# Altium project LED_Board.PrjPcb
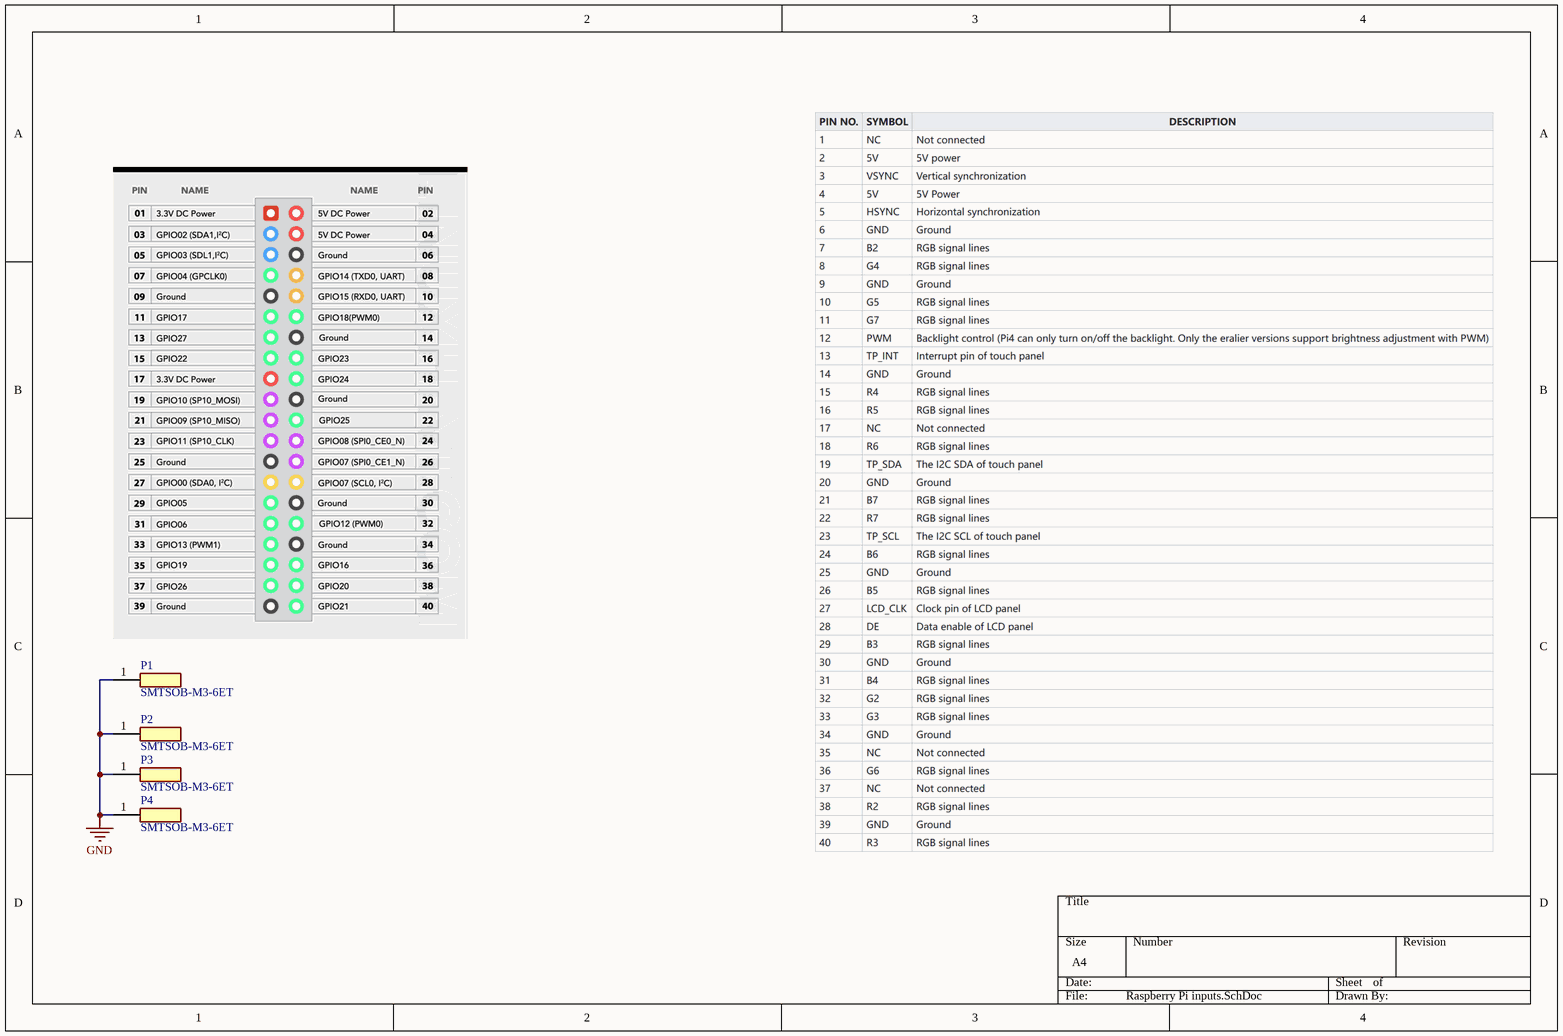
[diagram p0: Raspberry Pi inputs.SchDoc]
3 sheets, 57 parts. Net scope: flat (ports and power ports of the same name join across sheets).
Board file: PCB.PcbDoc
Sheets:
  Raspberry Pi inputs.SchDoc
  LEDs_Sheet_1.SchDoc
  LEDs_Sheet_2.SchDoc

## Sheet Raspberry Pi inputs.SchDoc
size A4; SheetNumber: 1; SheetTotal: 3

### Parts
P1  SMTSOB-M3-6ET  [SMTSOB-M3-6ET]
P2  SMTSOB-M3-6ET  [SMTSOB-M3-6ET]
P3  SMTSOB-M3-6ET  [SMTSOB-M3-6ET]
P4  SMTSOB-M3-6ET  [SMTSOB-M3-6ET]

### Nets
GND: P1.1 P2.1 P3.1 P4.1

### Library data of the parts
P1-P4 = SMTSOB-M3-6ET: Spacer 8mm

## Sheet LEDs_Sheet_1.SchDoc
size A4; SheetNumber: 2; SheetTotal: 3
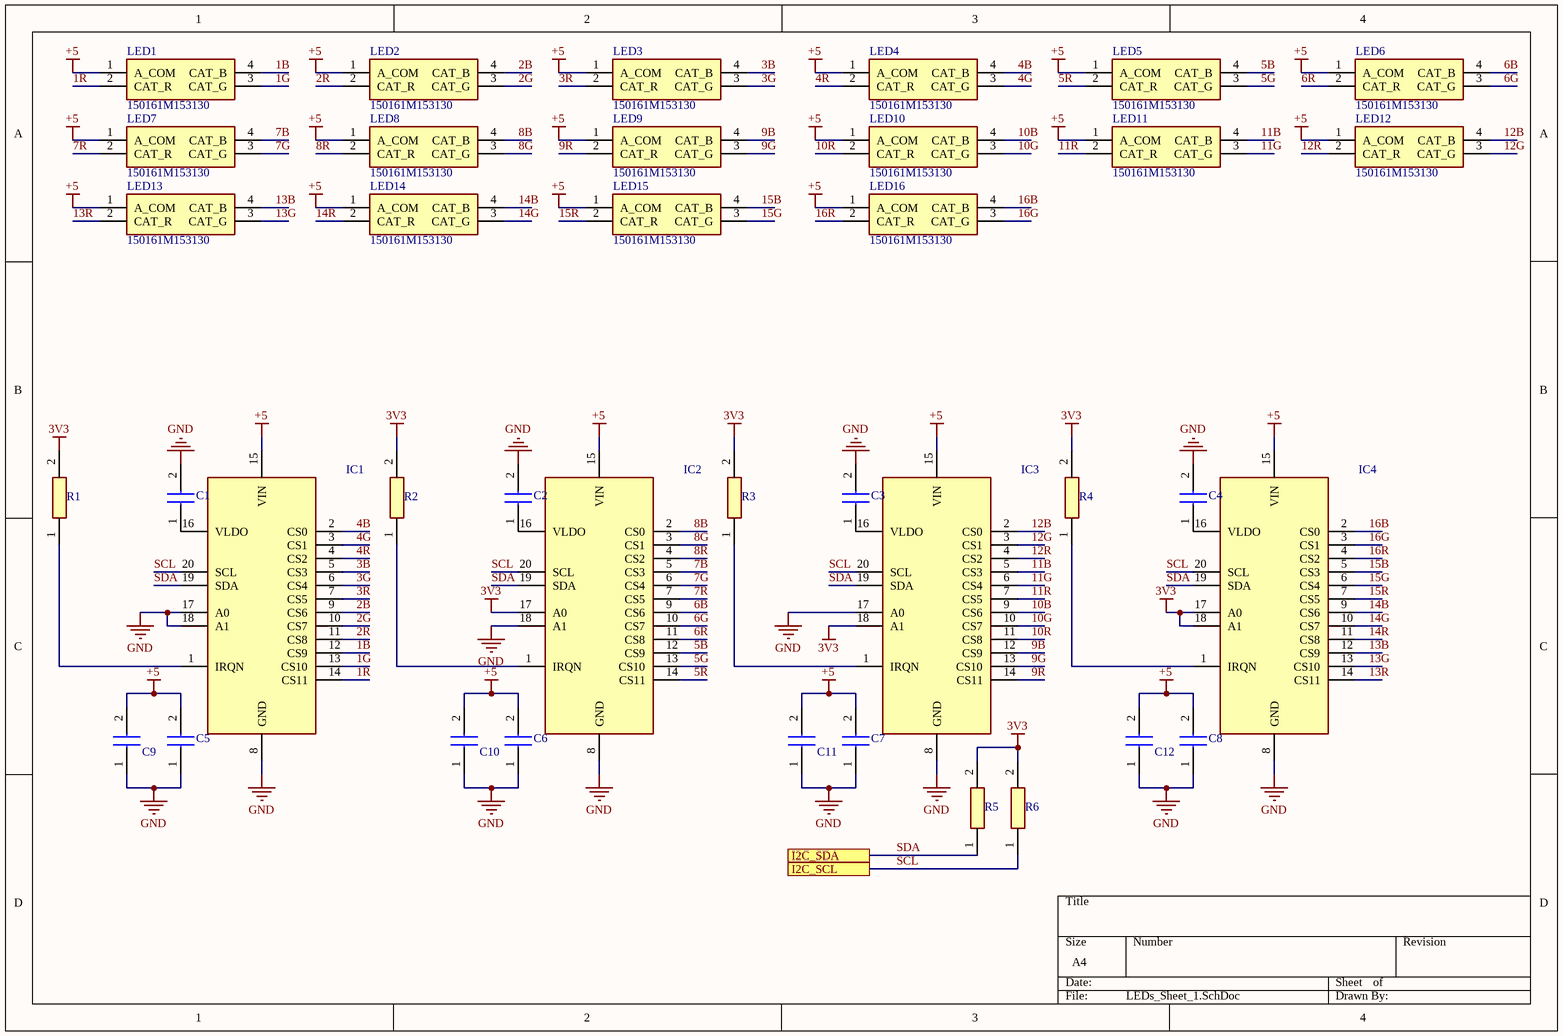
[diagram p1: LEDs_Sheet_1.SchDoc]

### Parts
C1  C0402C105K9PAC  [CAPC1005X55N]  (value not drawn)
C2  C0402C105K9PAC  [CAPC1005X55N]  (value not drawn)
C3  C0402C105K9PAC  [CAPC1005X55N]  (value not drawn)
C4  C0402C105K9PAC  [CAPC1005X55N]  (value not drawn)
C5  C0402C105K9PAC  [CAPC1005X55N]  (value not drawn)
C6  C0402C105K9PAC  [CAPC1005X55N]  (value not drawn)
C7  C0402C105K9PAC  [CAPC1005X55N]  (value not drawn)
C8  C0402C105K9PAC  [CAPC1005X55N]  (value not drawn)
C9  C1005X7S1A225K050BC  [C1005_Commercial]  (value not drawn)
C10  C1005X7S1A225K050BC  [C1005_Commercial]  (value not drawn)
C11  C1005X7S1A225K050BC  [C1005_Commercial]  (value not drawn)
C12  C1005X7S1A225K050BC  [C1005_Commercial]  (value not drawn)
IC1  LED1202JR  [QFN20 3x3 (0,5mm pitch)]  (value not drawn)
IC2  LED1202JR  [QFN20 3x3 (0,5mm pitch)]  (value not drawn)
IC3  LED1202JR  [QFN20 3x3 (0,5mm pitch)]  (value not drawn)
IC4  LED1202JR  [QFN20 3x3 (0,5mm pitch)]  (value not drawn)
LED1  150161M153130  [150161M153130]
LED2  150161M153130  [150161M153130]
LED3  150161M153130  [150161M153130]
LED4  150161M153130  [150161M153130]
LED5  150161M153130  [150161M153130]
LED6  150161M153130  [150161M153130]
LED7  150161M153130  [150161M153130]
LED8  150161M153130  [150161M153130]
LED9  150161M153130  [150161M153130]
LED10  150161M153130  [150161M153130]
LED11  150161M153130  [150161M153130]
LED12  150161M153130  [150161M153130]
LED13  150161M153130  [150161M153130]
LED14  150161M153130  [150161M153130]
LED15  150161M153130  [150161M153130]
LED16  150161M153130  [150161M153130]
R1  MCS04020D1001BE000  [RESC1005X37N]  (value not drawn)
R2  MCS04020D1001BE000  [RESC1005X37N]  (value not drawn)
R3  MCS04020D1001BE000  [RESC1005X37N]  (value not drawn)
R4  MCS04020D1001BE000  [RESC1005X37N]  (value not drawn)
R5  MCS04020D1001BE000  [RESC1005X37N]  (value not drawn)
R6  MCS04020D1001BE000  [RESC1005X37N]  (value not drawn)

### Ports
I2C_SCL, I2C_SDA

### Nets
3V3: IC2.17(A0) IC3.18(A1) IC4.17(A0) IC4.18(A1) R1.2 R2.2 R3.2 R4.2 R5.2 R6.2
+5: C5.2 C6.2 C7.2 C8.2 C9.2 C10.2 C11.2 C12.2 IC1.15(VIN) IC2.15(VIN) IC3.15(VIN) IC4.15(VIN) LED1.1(A_COM) LED2.1(A_COM) LED3.1(A_COM) LED4.1(A_COM) LED5.1(A_COM) LED6.1(A_COM) LED7.1(A_COM) LED8.1(A_COM) LED9.1(A_COM) LED10.1(A_COM) LED11.1(A_COM) LED12.1(A_COM) LED13.1(A_COM) LED14.1(A_COM) LED15.1(A_COM) LED16.1(A_COM)
GND: C1.2 C2.2 C3.2 C4.2 C5.1 C6.1 C7.1 C8.1 C9.1 C10.1 C11.1 C12.1 IC1.8(GND) IC1.17(A0) IC1.18(A1) IC2.8(GND) IC2.18(A1) IC3.8(GND) IC3.17(A0) IC4.8(GND)
1B: IC1.12(CS9) LED1.4(CAT_B)
1G: IC1.13(CS10) LED1.3(CAT_G)
1R: IC1.14(CS11) LED1.2(CAT_R)
2B: IC1.9(CS6) LED2.4(CAT_B)
2G: IC1.10(CS7) LED2.3(CAT_G)
2R: IC1.11(CS8) LED2.2(CAT_R)
3B: IC1.5(CS3) LED3.4(CAT_B)
3G: IC1.6(CS4) LED3.3(CAT_G)
3R: IC1.7(CS5) LED3.2(CAT_R)
4B: IC1.2(CS0) LED4.4(CAT_B)
4G: IC1.3(CS1) LED4.3(CAT_G)
4R: IC1.4(CS2) LED4.2(CAT_R)
5B: IC2.12(CS9) LED5.4(CAT_B)
5G: IC2.13(CS10) LED5.3(CAT_G)
5R: IC2.14(CS11) LED5.2(CAT_R)
6B: IC2.9(CS6) LED6.4(CAT_B)
6G: IC2.10(CS7) LED6.3(CAT_G)
6R: IC2.11(CS8) LED6.2(CAT_R)
7B: IC2.5(CS3) LED7.4(CAT_B)
7G: IC2.6(CS4) LED7.3(CAT_G)
7R: IC2.7(CS5) LED7.2(CAT_R)
8B: IC2.2(CS0) LED8.4(CAT_B)
8G: IC2.3(CS1) LED8.3(CAT_G)
8R: IC2.4(CS2) LED8.2(CAT_R)
9B: IC3.12(CS9) LED9.4(CAT_B)
9G: IC3.13(CS10) LED9.3(CAT_G)
9R: IC3.14(CS11) LED9.2(CAT_R)
10B: IC3.9(CS6) LED10.4(CAT_B)
10G: IC3.10(CS7) LED10.3(CAT_G)
10R: IC3.11(CS8) LED10.2(CAT_R)
11B: IC3.5(CS3) LED11.4(CAT_B)
11G: IC3.6(CS4) LED11.3(CAT_G)
11R: IC3.7(CS5) LED11.2(CAT_R)
12B: IC3.2(CS0) LED12.4(CAT_B)
12G: IC3.3(CS1) LED12.3(CAT_G)
12R: IC3.4(CS2) LED12.2(CAT_R)
13B: IC4.12(CS9) LED13.4(CAT_B)
13G: IC4.13(CS10) LED13.3(CAT_G)
13R: IC4.14(CS11) LED13.2(CAT_R)
14B: IC4.9(CS6) LED14.4(CAT_B)
14G: IC4.10(CS7) LED14.3(CAT_G)
14R: IC4.11(CS8) LED14.2(CAT_R)
15B: IC4.5(CS3) LED15.4(CAT_B)
15G: IC4.6(CS4) LED15.3(CAT_G)
15R: IC4.7(CS5) LED15.2(CAT_R)
16B: IC4.2(CS0) LED16.4(CAT_B)
16G: IC4.3(CS1) LED16.3(CAT_G)
16R: IC4.4(CS2) LED16.2(CAT_R)
SCL: IC1.20(SCL) IC2.20(SCL) IC3.20(SCL) IC4.20(SCL) R6.1 ; port I2C_SCL
SDA: IC1.19(SDA) IC2.19(SDA) IC3.19(SDA) IC4.19(SDA) R5.1 ; port I2C_SDA
NetC1_1: C1.1 IC1.16(VLDO)
NetC2_1: C2.1 IC2.16(VLDO)
NetC3_1: C3.1 IC3.16(VLDO)
NetC4_1: C4.1 IC4.16(VLDO)
NetIC1_1: IC1.1(IRQN) R1.1
NetIC2_1: IC2.1(IRQN) R2.1
NetIC3_1: IC3.1(IRQN) R3.1
NetIC4_1: IC4.1(IRQN) R4.1

### Library data of the parts
C1-C8 = C0402C105K9PAC: Capacitor; Manufacturer_Name: KEMET; Datasheet Link: https://content.kemet.com/datasheets/KEM_C1002_X7R_SMD.pdf; Height: 0.55mm; Manufacturer_Part_Number: C0402C105K9PAC; Mouser Part Number: 80-C0402C105K9PAC; Mouser Price/Stock: https://www.mouser.co.uk/ProductDetail/KEMET/C0402C105K9PAC?qs=AHS6Mz2dKxPyNrxaU50ZkQ%3D%3D; Arrow Part Number: C0402C105K9PAC; Arrow Price/Stock: https://www.arrow.com/en/products/c0402c105k9pac/kemet-corporation?region=nac
C9-C12 = C1005X7S1A225K050BC: 2µ2F 0402; Manufacturer_Name: TDK; Datasheet Link: https://product.tdk.com/system/files/dam/doc/product/capacitor/ceramic/mlcc/catalog/mlcc_commercial_general_en.pdf; Height: 0.55mm; Manufacturer_Part_Number: C1005X7S1A225K050BC; Mouser Part Number: 810-C1005X7S1A225K; Mouser Price/Stock: https://www.mouser.co.uk/ProductDetail/TDK/C1005X7S1A225K050BC?qs=dfay7wIA1uFANmjMJAzwOA%3D%3D; Arrow Part Number: C1005X7S1A225K050BC; Arrow Price/Stock: https://www.arrow.com/en/products/c1005x7s1a225k050bc/tdk?region=nac
IC1-IC4 = LED1202JR: Integrated Circuit; Manufacturer_Name: STMicroelectronics; Datasheet Link: https://componentsearchengine.com/Datasheets/1/LED1202JR.pdf; Height: 0.653mm; Manufacturer_Part_Number: LED1202JR; Mouser Part Number: 511-LED1202JR; Mouser Price/Stock: https://www.mouser.co.uk/ProductDetail/STMicroelectronics/LED1202JR?qs=P19jvy6W2mcPsIm9dkDZbQ%3D%3D; Arrow Part Number: LED1202JR; Arrow Price/Stock: https://www.arrow.com/en/products/led1202jr/stmicroelectronics?region=nac
LED1-LED16 = 150161M153130: LED; Manufacturer_Name: Wurth Elektronik; Datasheet Link: https://www.mouser.co.uk/datasheet/2/445/150161M153130-1838821.pdf; Height: 1.7mm; Manufacturer_Part_Number: 150161M153130; Mouser Part Number: 710-150161M153130; Mouser Price/Stock: https://www.mouser.co.uk/ProductDetail/Wurth-Elektronik/150161M153130?qs=GedFDFLaBXEcD4evLrps3w%3D%3D
R1-R6 = MCS04020D1001BE000: Resistor 1k 0402; Manufacturer_Name: Vishay; Datasheet Link: http://www.vishay.com/docs/28705/mcx0x0xpro.pdf; Height: 0.37mm; Manufacturer_Part_Number: MCS04020D1001BE000; Mouser Part Number: 594-MCS04020D1001BE0; Mouser Price/Stock: https://www.mouser.co.uk/ProductDetail/Vishay-Beyschlag/MCS04020D1001BE000?qs=H5EaGE3Pc5m43MFwYZQH1Q%3D%3D

## Sheet LEDs_Sheet_2.SchDoc
size A4; SheetNumber: 3; SheetTotal: 3
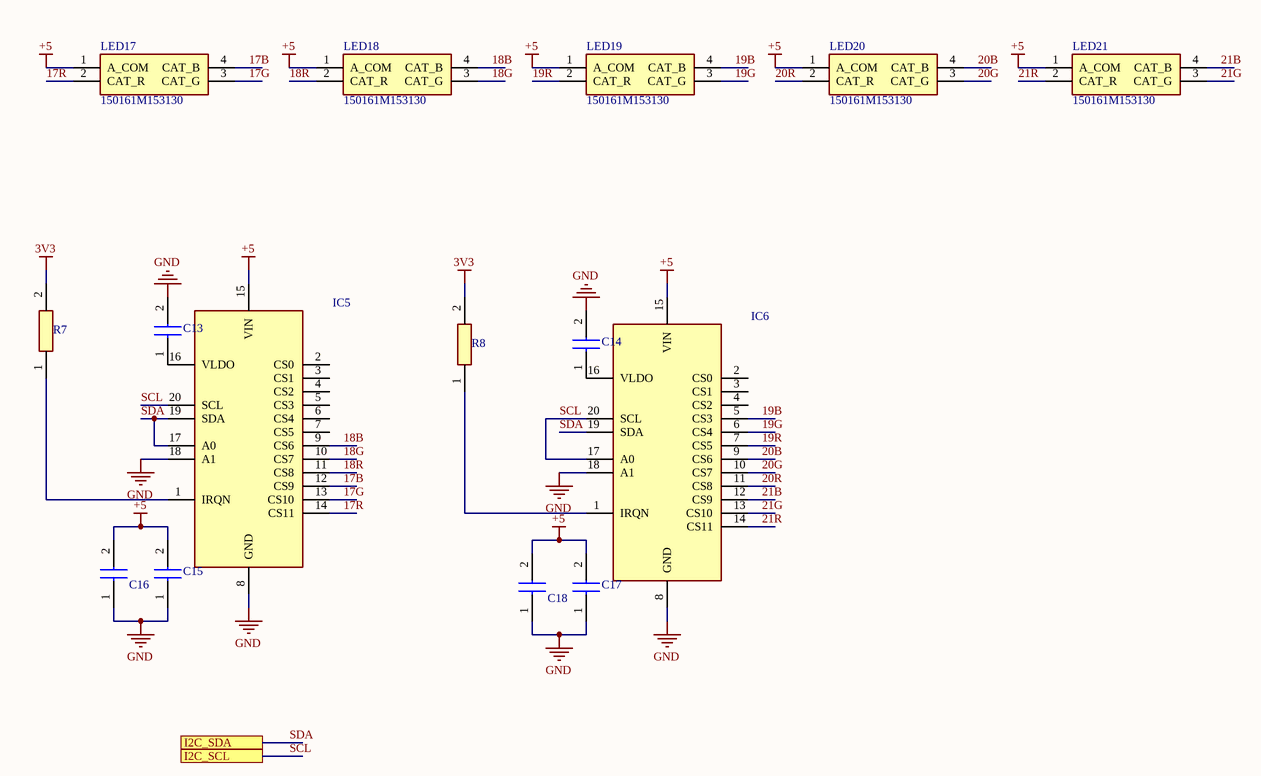
[diagram p2: LEDs_Sheet_2.SchDoc]

### Parts
C13  C0402C105K9PAC  [CAPC1005X55N]  (value not drawn)
C14  C0402C105K9PAC  [CAPC1005X55N]  (value not drawn)
C15  C0402C105K9PAC  [CAPC1005X55N]  (value not drawn)
C16  C1005X7S1A225K050BC  [C1005_Commercial]  (value not drawn)
C17  C0402C105K9PAC  [CAPC1005X55N]  (value not drawn)
C18  C1005X7S1A225K050BC  [C1005_Commercial]  (value not drawn)
IC5  LED1202JR  [QFN20 3x3 (0,5mm pitch)]  (value not drawn)
IC6  LED1202JR  [QFN20 3x3 (0,5mm pitch)]  (value not drawn)
LED17  150161M153130  [150161M153130]
LED18  150161M153130  [150161M153130]
LED19  150161M153130  [150161M153130]
LED20  150161M153130  [150161M153130]
LED21  150161M153130  [150161M153130]
R7  MCS04020D1001BE000  [RESC1005X37N]  (value not drawn)
R8  MCS04020D1001BE000  [RESC1005X37N]  (value not drawn)

### Ports
I2C_SCL, I2C_SDA

### Nets
3V3: R7.2 R8.2
+5: C15.2 C16.2 C17.2 C18.2 IC5.15(VIN) IC6.15(VIN) LED17.1(A_COM) LED18.1(A_COM) LED19.1(A_COM) LED20.1(A_COM) LED21.1(A_COM)
GND: C13.2 C14.2 C15.1 C16.1 C17.1 C18.1 IC5.8(GND) IC5.18(A1) IC6.8(GND) IC6.18(A1)
17B: IC5.12(CS9) LED17.4(CAT_B)
17G: IC5.13(CS10) LED17.3(CAT_G)
17R: IC5.14(CS11) LED17.2(CAT_R)
18B: IC5.9(CS6) LED18.4(CAT_B)
18G: IC5.10(CS7) LED18.3(CAT_G)
18R: IC5.11(CS8) LED18.2(CAT_R)
19B: IC6.5(CS3) LED19.4(CAT_B)
19G: IC6.6(CS4) LED19.3(CAT_G)
19R: IC6.7(CS5) LED19.2(CAT_R)
20B: IC6.9(CS6) LED20.4(CAT_B)
20G: IC6.10(CS7) LED20.3(CAT_G)
20R: IC6.11(CS8) LED20.2(CAT_R)
21B: IC6.12(CS9) LED21.4(CAT_B)
21G: IC6.13(CS10) LED21.3(CAT_G)
21R: IC6.14(CS11) LED21.2(CAT_R)
SCL: IC5.20(SCL) IC6.17(A0) IC6.20(SCL) ; port I2C_SCL
SDA: IC5.17(A0) IC5.19(SDA) IC6.19(SDA) ; port I2C_SDA
NetC13_1: C13.1 IC5.16(VLDO)
NetC14_1: C14.1 IC6.16(VLDO)
NetIC5_1: IC5.1(IRQN) R7.1
NetIC6_1: IC6.1(IRQN) R8.1

Not connected (* = marked no-connect by the designer): IC5 2(CS0) 3(CS1) 4(CS2) 5(CS3) 6(CS4) 7(CS5); IC6 2(CS0) 3(CS1) 4(CS2)

### Library data of the parts
C13-C15 C17 = C0402C105K9PAC: Capacitor; Manufacturer_Name: KEMET; Datasheet Link: https://content.kemet.com/datasheets/KEM_C1002_X7R_SMD.pdf; Height: 0.55mm; Manufacturer_Part_Number: C0402C105K9PAC; Mouser Part Number: 80-C0402C105K9PAC; Mouser Price/Stock: https://www.mouser.co.uk/ProductDetail/KEMET/C0402C105K9PAC?qs=AHS6Mz2dKxPyNrxaU50ZkQ%3D%3D; Arrow Part Number: C0402C105K9PAC; Arrow Price/Stock: https://www.arrow.com/en/products/c0402c105k9pac/kemet-corporation?region=nac
C16 C18 = C1005X7S1A225K050BC: 2µ2F 0402; Manufacturer_Name: TDK; Datasheet Link: https://product.tdk.com/system/files/dam/doc/product/capacitor/ceramic/mlcc/catalog/mlcc_commercial_general_en.pdf; Height: 0.55mm; Manufacturer_Part_Number: C1005X7S1A225K050BC; Mouser Part Number: 810-C1005X7S1A225K; Mouser Price/Stock: https://www.mouser.co.uk/ProductDetail/TDK/C1005X7S1A225K050BC?qs=dfay7wIA1uFANmjMJAzwOA%3D%3D; Arrow Part Number: C1005X7S1A225K050BC; Arrow Price/Stock: https://www.arrow.com/en/products/c1005x7s1a225k050bc/tdk?region=nac
IC5 IC6 = LED1202JR: as IC1 on sheet LEDs_Sheet_1; Datasheet Link: https://componentsearchengine.com/Datasheets/1/LED1202JR.pdf; Height: 0.653mm; Manufacturer_Part_Number: LED1202JR; Mouser Part Number: 511-LED1202JR; Mouser Price/Stock: https://www.mouser.co.uk/ProductDetail/STMicroelectronics/LED1202JR?qs=P19jvy6W2mcPsIm9dkDZbQ%3D%3D; Arrow Part Number: LED1202JR; Arrow Price/Stock: https://www.arrow.com/en/products/led1202jr/stmicroelectronics?region=nac
LED17-LED21 = 150161M153130: LED; Manufacturer_Name: Wurth Elektronik; Datasheet Link: https://www.mouser.co.uk/datasheet/2/445/150161M153130-1838821.pdf; Height: 1.7mm; Manufacturer_Part_Number: 150161M153130; Mouser Part Number: 710-150161M153130; Mouser Price/Stock: https://www.mouser.co.uk/ProductDetail/Wurth-Elektronik/150161M153130?qs=GedFDFLaBXEcD4evLrps3w%3D%3D
R7 R8 = MCS04020D1001BE000: as R1 on sheet LEDs_Sheet_1; Datasheet Link: http://www.vishay.com/docs/28705/mcx0x0xpro.pdf; Height: 0.37mm; Manufacturer_Part_Number: MCS04020D1001BE000; Mouser Part Number: 594-MCS04020D1001BE0; Mouser Price/Stock: https://www.mouser.co.uk/ProductDetail/Vishay-Beyschlag/MCS04020D1001BE000?qs=H5EaGE3Pc5m43MFwYZQH1Q%3D%3D

## Nets that join several sheets
3V3: LEDs_Sheet_1 (10 pins), LEDs_Sheet_2 (R7.2 R8.2)
+5: LEDs_Sheet_1 (28 pins), LEDs_Sheet_2 (11 pins)
GND: Raspberry Pi inputs (P1.1 P2.1 P3.1 P4.1), LEDs_Sheet_1 (20 pins), LEDs_Sheet_2 (10 pins)
SCL: LEDs_Sheet_1 (5 pins), LEDs_Sheet_2 (IC5.20 IC6.17 IC6.20)
SDA: LEDs_Sheet_1 (5 pins), LEDs_Sheet_2 (IC5.17 IC5.19 IC6.19)